# Altium schematic sheet Sheet1.SchDoc
size A3
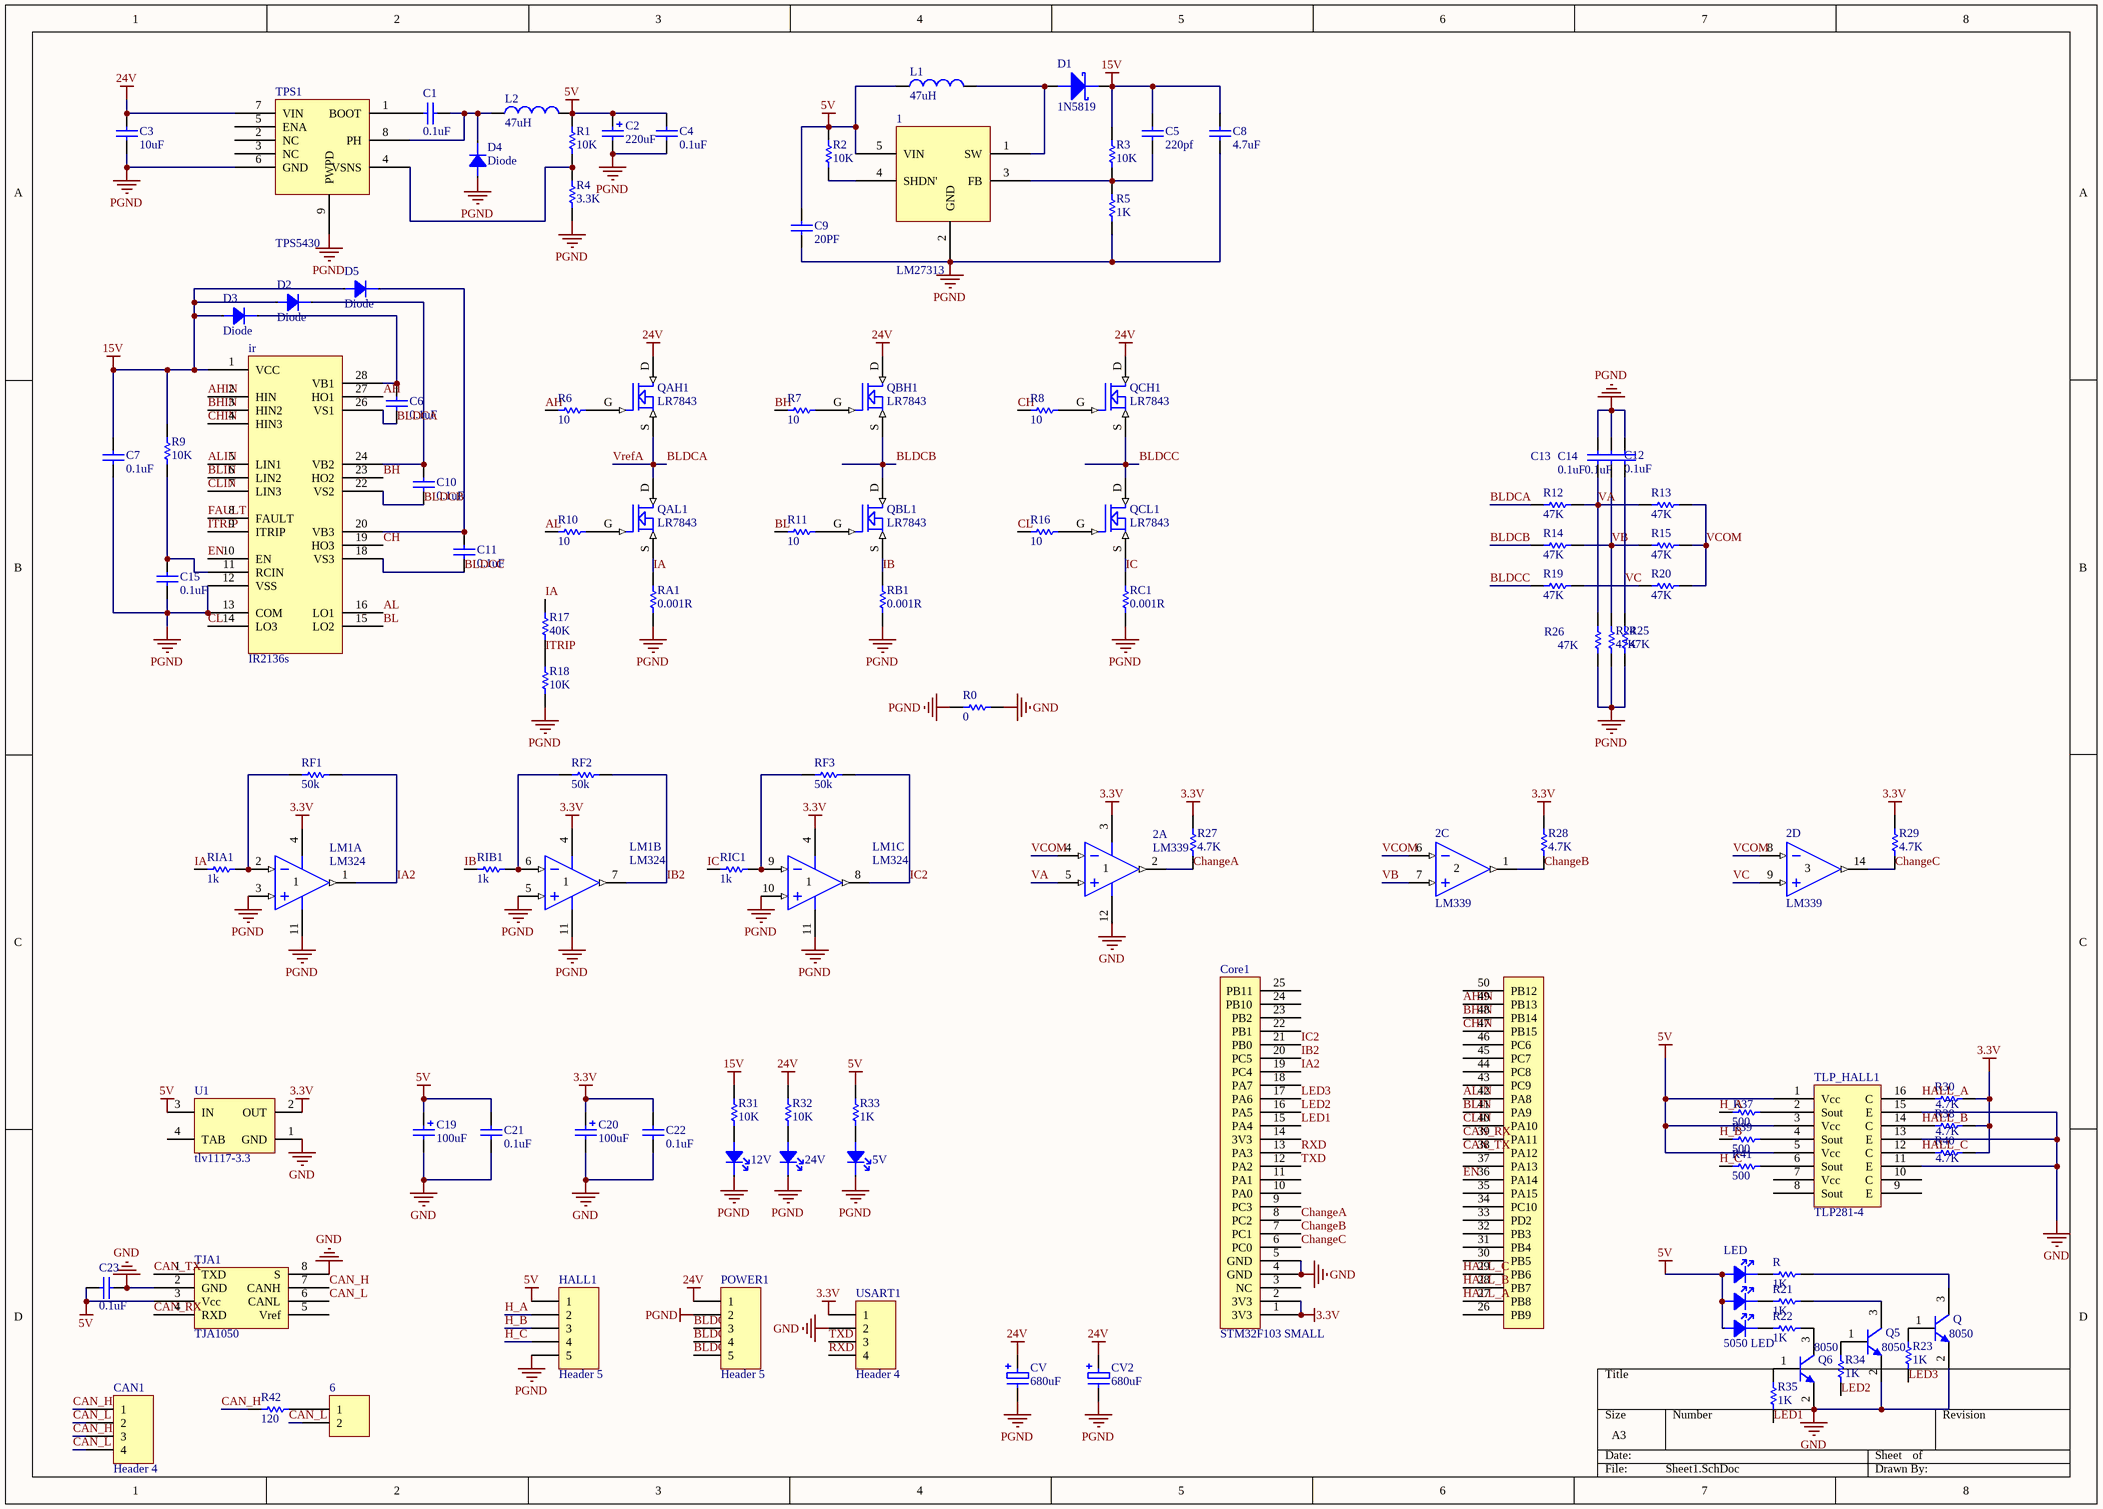
[diagram p0: Sheet1.SchDoc]

## Parts
1  LM27313  [LM27313]
2  LM339  [SOP14]  (parts A,C,D of 5)
5V  lED  [0805D]  (value not drawn)
6  Header 2  [SIP2]  (value not drawn)
12V  lED  [0805D]  (value not drawn)
24V  lED  [0805D]  (value not drawn)
C1  value 0.1uF  [CAP-MLCC-0603]  (hidden comment: Cap)
C2  value 220uF  [CAP-TAN-7343/CAPD]  (hidden comment: Cap Pol1)
C3  value 10uF  [0805C]  (hidden comment: Cap)
C4  value 0.1uF  [CAP-MLCC-0603]  (hidden comment: Cap)
C5  value 220pf  [CAP-MLCC-0603]  (hidden comment: Cap)
C6  value 0.1uF  [0805C]  (hidden comment: Cap)
C7  value 0.1uF  [0805C]  (hidden comment: Cap)
C8  value 4.7uF  [CAP-MLCC-0603]  (hidden comment: Cap)
C9  value 20PF  [CAP-MLCC-0603]  (hidden comment: Cap)
C10  value 0.1uF  [0805C]  (hidden comment: Cap)
C11  value 0.1uF  [0805C]  (hidden comment: Cap)
C12  value 0.1uF  [CAP-MLCC-0603]  (hidden comment: Cap)
C13  value 0.1uF  [CAP-MLCC-0603]  (hidden comment: Cap)
C14  value 0.1uF  [CAP-MLCC-0603]  (hidden comment: Cap)
C15  value 0.1uF  [CAP-MLCC-0603]  (hidden comment: Cap)
C19  value 100uF  [6032C]  (hidden comment: Cap Pol)
C20  value 100uF  [6032C]  (hidden comment: Cap Pol)
C21  value 0.1uF  [CAP-MLCC-0603]  (hidden comment: Cap)
C22  value 0.1uF  [CAP-MLCC-0603]  (hidden comment: Cap)
C23  value 0.1uF  [CAP-MLCC-0603]  (hidden comment: Cap)
CAN1  Header 4  [Green_4P]
Core1  STM32F103 SMALL  [STM32F103Small]
CV  680uF  [C_ELE]
CV2  680uF  [C_ELE]
D1  1N5819  [0805D]
D2  Diode  [0805D]
D3  Diode  [0805D]
D4  Diode  [SS34]
D5  Diode  [0805D]
HALL1  Header 5  [Green_5P]
ir  IR2136s  [ir2136s]
L1  value 47uH  [CD52]  (hidden comment: Inductor)
L2  value 47uH  [CD52]  (hidden comment: Inductor)
LED  5050 LED  [5050LED]
LM1  LM324  [SOP14]  (parts A,B,C of 4)
POWER1  Header 5  [Green_5P]
Q  8050  [SOT-23B_N]
Q5  8050  [SOT-23B_N]
Q6  8050  [SOT-23B_N]
QAH1  LR7843  [LR7843]
QAL1  LR7843  [LR7843]
QBH1  LR7843  [LR7843]
QBL1  LR7843  [LR7843]
QCH1  LR7843  [LR7843]
QCL1  LR7843  [LR7843]
R  value 1K  [RES-0603]  (hidden comment: Res1)
R0  value 0  [RES-0603]  (hidden comment: Res1)
R1  value 10K  [RES-0603]  (hidden comment: Res1)
R2  value 10K  [RES-0603]  (hidden comment: Res1)
R3  value 10K  [RES-0603]  (hidden comment: Res1)
R4  value 3.3K  [RES-0603]  (hidden comment: Res1)
R5  value 1K  [RES-0603]  (hidden comment: Res1)
R6  value 10  [RES-0603]  (hidden comment: Res1)
R7  value 10  [RES-0603]  (hidden comment: Res1)
R8  value 10  [RES-0603]  (hidden comment: Res1)
R9  value 10K  [RES-0603]  (hidden comment: Res1)
R10  value 10  [RES-0603]  (hidden comment: Res1)
R11  value 10  [RES-0603]  (hidden comment: Res1)
R12  value 47K  [RES-0603]  (hidden comment: Res1)
R13  value 47K  [RES-0603]  (hidden comment: Res1)
R14  value 47K  [RES-0603]  (hidden comment: Res1)
R15  value 47K  [RES-0603]  (hidden comment: Res1)
R16  value 10  [RES-0603]  (hidden comment: Res1)
R17  value 40K  [RES-0603]  (hidden comment: Res1)
R18  value 10K  [RES-0603]  (hidden comment: Res1)
R19  value 47K  [RES-0603]  (hidden comment: Res1)
R20  value 47K  [RES-0603]  (hidden comment: Res1)
R21  value 1K  [RES-0603]  (hidden comment: Res1)
R22  value 1K  [RES-0603]  (hidden comment: Res1)
R23  value 1K  [RES-0603]  (hidden comment: Res1)
R24  value 47K  [RES-0603]  (hidden comment: Res1)
R25  value 47K  [RES-0603]  (hidden comment: Res1)
R26  value 47K  [RES-0603]  (hidden comment: Res1)
R27  value 4.7K  [RES-0603]  (hidden comment: Res1)
R28  value 4.7K  [RES-0603]  (hidden comment: Res1)
R29  value 4.7K  [RES-0603]  (hidden comment: Res1)
R30  value 4.7K  [RES-0603]  (hidden comment: Res1)
R31  value 10K  [RES-0603]  (hidden comment: Res1)
R32  value 10K  [RES-0603]  (hidden comment: Res1)
R33  value 1K  [RES-0603]  (hidden comment: Res1)
R34  value 1K  [RES-0603]  (hidden comment: Res1)
R35  value 1K  [RES-0603]  (hidden comment: Res1)
R37  value 500  [RES-0603]  (hidden comment: Res1)
R38  value 4.7K  [RES-0603]  (hidden comment: Res1)
R39  value 500  [RES-0603]  (hidden comment: Res1)
R40  value 4.7K  [RES-0603]  (hidden comment: Res1)
R41  value 500  [RES-0603]  (hidden comment: Res1)
R42  value 120  [RES-0603]  (hidden comment: Res1)
RA1  value 0.001R  [2512R]  (hidden comment: Res1)
RB1  value 0.001R  [2512R]  (hidden comment: Res1)
RC1  value 0.001R  [2512R]  (hidden comment: Res1)
RF1  value 50k  [RES-0603]  (hidden comment: Res1)
RF2  value 50k  [RES-0603]  (hidden comment: Res1)
RF3  value 50k  [RES-0603]  (hidden comment: Res1)
RIA1  value 1k  [RES-0603]  (hidden comment: Res1)
RIB1  value 1k  [RES-0603]  (hidden comment: Res1)
RIC1  value 1k  [RES-0603]  (hidden comment: Res1)
TJA1  TJA1050  [TJA1050]
TLP_HALL1  TLP281-4  [SOP16]
TPS1  TPS5430  [TPS5430]
U1  tlv1117-3.3  [LM1117]
USART1  Header 4  [Green_4P]

## Nets
3.3V: 2.3(VEE) C20.1 C22.1 Core1.1(3V3) Core1.2(3V3) LM1.4(VEE) R27.2 R28.2 R29.2 R30.2 R38.2 R40.2 U1.2(OUT) USART1.1
5V: 1.5(VIN) C2.1 C4.2 C9.2 C19.1 C21.1 C23.2 HALL1.1 L1.1 L2.2 LED.A1 LED.A2 LED.A3 R1.2 R2.1 R33.2 TJA1.3(Vcc) TLP_HALL1.1(Vcc) TLP_HALL1.3(Vcc) TLP_HALL1.5(Vcc) U1.3(IN)
15V: C5.2 C7.2 C8.2 D1.K D2.A D3.A D5.A ir.1(VCC) R3.1 R9.2 R31.2
24V: C3.1 CV.1 CV2.1 POWER1.1 QAH1.D QBH1.D QCH1.D R32.2 TPS1.7(VIN)
GND: 2.12 C19.2 C20.2 C21.2 C22.2 C23.1 Core1.4(GND) Core1.5(GND) Q.2(E) Q5.2(E) Q6.2(E) R0.1 TJA1.2(GND) TJA1.8(S) TLP_HALL1.11(E) TLP_HALL1.13(E) TLP_HALL1.15(E) U1.1(GND) USART1.2
PGND: 1.2(GND) 5V.K 12V.K 24V.K C2.2 C3.2 C4.1 C7.1 C8.1 C9.1 C12.1 C13.2 C14.2 C15.1 CV.2 CV2.2 D4.A HALL1.5 ir.12(VSS) ir.13(COM) LM1.3(IN+) LM1.5(IN+) LM1.10(IN+) LM1.11(VEE) POWER1.2 R0.2 R4.1 R5.2 R18.2 R24.1 R25.1 R26.1 RA1.1 RB1.1 RC1.1 TPS1.6(GND) TPS1.9(PWPD)
AH: ir.27(HO1) R6.2
AHIN: Core1.49(PB13) ir.2(HIN)
AL: ir.16(LO1) R10.2
ALIN: Core1.42(PA8) ir.5(LIN1)
BH: ir.23(HO2) R7.2
BHIN: Core1.48(PB14) ir.3(HIN2)
BL: ir.15(LO2) R11.2
BLDCA: C6.1 ir.26(VS1) POWER1.3 QAH1.S QAL1.D R12.1  [also labelled VrefA]
BLDCB: C10.1 ir.22(VS2) POWER1.4 QBH1.S QBL1.D R14.1
BLDCC: C11.1 ir.18(VS3) POWER1.5 QCH1.S QCL1.D R19.1
BLIN: Core1.41(PA9) ir.6(LIN2)
CAN_H: CAN1.1 CAN1.3 R42.1 TJA1.7(CANH)
CAN_L: 6.2 CAN1.2 CAN1.4 TJA1.6(CANL)
CAN_RX: Core1.39(PA11) TJA1.4(RXD)
CAN_TX: Core1.38(PA12) TJA1.1(TXD)
CH: ir.19(HO3) R8.2
ChangeA: 2.2(OUT) Core1.8(PC2) R27.1
ChangeB: 2.1(OUT) Core1.7(PC1) R28.1
ChangeC: 2.14(OUT) Core1.6(PC0) R29.1
CHIN: Core1.47(PB15) ir.4(HIN3)
CL: ir.14(LO3) R16.2
CLIN: Core1.40(PA10) ir.7(LIN3)
EN: Core1.36(PA14) ir.10(EN)
FAULT: ir.8(FAULT)
H_A: HALL1.2 R37.1
H_B: HALL1.3 R39.1
H_C: HALL1.4 R41.1
HALL_A: Core1.27(PB8) R30.1 TLP_HALL1.16(C)
HALL_B: Core1.28(PB7) R38.1 TLP_HALL1.14(C)
HALL_C: Core1.29(PB6) R40.1 TLP_HALL1.12(C)
IA: QAL1.S R17.1 RA1.2 RIA1.2
IA2: Core1.19(PC4) LM1.1(OUT) RF1.1
IB: QBL1.S RB1.2 RIB1.2
IB2: Core1.20(PC5) LM1.7(OUT) RF2.1
IC: QCL1.S RC1.2 RIC1.2
IC2: Core1.21(PB0) LM1.8(OUT) RF3.1
ITRIP: ir.9(ITRIP) R17.2 R18.1
LED1: Core1.15(PA4) R35.2
LED2: Core1.16(PA5) R34.2
LED3: Core1.17(PA6) R23.2
RXD: Core1.13(PA3) USART1.4
TXD: Core1.12(PA2) USART1.3
VA: 2.5(IN+) C13.1 R12.2 R13.1 R26.2
VB: 2.7(IN+) C12.2 R14.2 R15.1 R24.2
VC: 2.9(IN+) C14.1 R19.2 R20.1 R25.2
VCOM: 2.4(IN-) 2.6(IN-) 2.8(IN-) R13.2 R15.2 R20.2
Net1_1: 1.1(SW) D1.A L1.2
Net1_3: 1.3(FB) C5.1 R3.2 R5.1
Net1_4: 1.4(SHDN') R2.2
Net5V_A: 5V.A R33.1
Net6_1: 6.1 R42.2
Net12V_A: 12V.A R31.1
Net24V_A: 24V.A R32.1
NetC1_1: C1.1 TPS1.1(BOOT)
NetC1_2: C1.2 D4.K L2.1 TPS1.8(PH)
NetC6_2: C6.2 D3.K ir.28(VB1)
NetC10_2: C10.2 D2.K ir.24(VB2)
NetC11_2: C11.2 D5.K ir.20(VB3)
NetC15_2: C15.2 ir.11(RCIN) R9.1
NetLED_K1: LED.K1 R.2
NetLED_K2: LED.K2 R21.2
NetLED_K3: LED.K3 R22.2
NetLM1_2: LM1.2(IN-) RF1.2 RIA1.1
NetLM1_6: LM1.6(IN-) RF2.2 RIB1.1
NetLM1_9: LM1.9(IN-) RF3.2 RIC1.1
NetQ5_1: Q5.1(B) R34.1
NetQ5_3: Q5.3(C) R21.1
NetQ6_1: Q6.1(B) R35.1
NetQ6_3: Q6.3(C) R22.1
NetQ_1: Q.1(B) R23.1
NetQ_3: Q.3(C) R.1
NetQAH1_G: QAH1.G R6.1
NetQAL1_G: QAL1.G R10.1
NetQBH1_G: QBH1.G R7.1
NetQBL1_G: QBL1.G R11.1
NetQCH1_G: QCH1.G R8.1
NetQCL1_G: QCL1.G R16.1
NetR1_1: R1.1 R4.2 TPS1.4(VSNS)
NetR37_2: R37.2 TLP_HALL1.2(Sout)
NetR39_2: R39.2 TLP_HALL1.4(Sout)
NetR41_2: R41.2 TLP_HALL1.6(Sout)

Not connected (* = marked no-connect by the designer): Core1 3(NC) 9(PC3) 10(PA0) 11(PA1) 14(3V3) 18(PA7) 22(PB1) 23(PB2) 24(PB10) 25(PB11) 26(PB9) 30(PB5) 31(PB4) 32(PB3) 33(PD2) 34(PC10) 35(PA15) 37(PA13) 43(PC9) 44(PC8) 45(PC7) 46(PC6) 50(PB12); ir 17 21 25; TJA1 5(Vref); TLP_HALL1 7(Vcc) 8(Sout) 9(E) 10(C); TPS1 2(NC) 3(NC) 5(ENA); U1 4(TAB)

## Library data of the parts
5V 12V 24V = 00-D-LED
6 = Header 2: Header, 2-Pin; LatestRevisionDate: 17-Jul-2002; LatestRevisionNote: Re-released for DXP Platform.; Publisher: Altium Limited
C1 C3 C4 C6 C7 C10-C15 C21-C23 = Cap: Capacitor; Published: 8-Jun-2000; LatestRevisionDate: 17-Jul-2002; LatestRevisionNote: Re-released for DXP Platform.; PackageReference: RAD-0.3; Publisher: Altium Limited
C2 = Cap Pol1: Polarized Capacitor (Radial); Published: 8-Jun-2000; LatestRevisionDate: 17-Jul-2002; LatestRevisionNote: Re-released for DXP Platform.; PackageReference: RB7.6-15; Publisher: Altium Limited
C5 C8 C9 = Cap_1: Capacitor; Published: 8-Jun-2000; LatestRevisionDate: 17-Jul-2002; LatestRevisionNote: Re-released for DXP Platform.; PackageReference: RAD-0.3; Publisher: Altium Limited
C19 C20 = Cap Pol: Polarized Capacitor (Radial); Published: 8-Jun-2000; LatestRevisionDate: 17-Jul-2002; LatestRevisionNote: Re-released for DXP Platform.; PackageReference: RB7.6-15; Publisher: Altium Limited
CAN1 USART1 = Header 4: Header, 4-Pin; LatestRevisionDate: 17-Jul-2002; LatestRevisionNote: Re-released for DXP Platform.; Publisher: Altium Limited
CV CV2 = CAP-ELE: 电解电容; Value: *μF; Published: 8-Jun-2000; LatestRevisionDate: 17-Jul-2002; LatestRevisionNote: Re-released for DXP Platform.; PackageReference: RB7.6-15; Publisher: Altium Limited; PackageDescription: Polarized Capacitor (Radial); 2 Leads
D1 = D-MBRA140T3: MBRA140T3
HALL1 POWER1 = Header 5: Header, 5-Pin; LatestRevisionDate: 17-Jul-2002; LatestRevisionNote: Re-released for DXP Platform.; Publisher: Altium Limited
L1 L2 = Inductor: Code_IEC: 1005; Published: 8-Jun-2000; LatestRevisionDate: 17-Jul-2002; LatestRevisionNote: Re-released for DXP Platform.; PackageReference: 0402-A; Publisher: Altium Limited; Code_JEITA: 0402
Q Q5 Q6 = QNPN: NPN Bipolar Transistor; Published: 8-Jun-2000; LatestRevisionDate: 29-May-2009; LatestRevisionNote: IPC-7351 Footprint Added.; PackageVersion: Aug-1999; PackageReference: SOT-23B; Publisher: Altium Limited; PackageDescription: 3-Pin SOT-23 Package 0.95 mm Pitch, 2.4 mm Lead Span
R R0 R1 R4 R6-R35 R37-R42 RA1 RB1 RC1 RF1-RF3 RIA1 RIB1 RIC1 = Res1: Resistor; Published: 8-Jun-2000; LatestRevisionDate: 17-Jul-2002; LatestRevisionNote: Re-released for DXP Platform.; PackageReference: AXIAL-0.3; Publisher: Altium Limited
R2 R3 R5 = Res1_1: Resistor; Published: 8-Jun-2000; LatestRevisionDate: 17-Jul-2002; LatestRevisionNote: Re-released for DXP Platform.; PackageReference: AXIAL-0.3; Publisher: Altium Limited
TJA1 = TJA1050: CAN总线收发器
TLP_HALL1 = IC-TLP281-4
U1 = LM1117IMP-5.0: 800mA Low-Dropout Linear Regulator; Manufacturer: National Semiconductor; CompType: LDO IC; PackageTopMarking: XYTT*N06B; PowerWise: N; Published: 4-Dec-2008; DatasheetVersion: Apr-2006; PackageVersion: revB, Apr-2003; PackageReference: MP04A; Publisher: Altium Limited; PackageDescription: Molded SOT-223, 6.50 x 3.56 x 1.6mm Body, 4 Lead, 2.3mm Pitch; PartNumber: LM1117IMP-5.0; RoHS: O; PinCount: 4; DigiKeyPartNumber: LM1117IMP-5.0CT-ND; Code_JEDEC: TO-261-AA; Code_IPC: SOT223-4; ComponentLink1Description: LM1117 Datasheet; ComponentLink1URL: http://www.national.com/ds/LM/LM1117.pdf; ComponentLink2Description: LM1117 Web Page; ComponentLink2URL: http://www.national.com/pf/LM/LM1117.html; ComponentLink3Description: MP04A Package Page; ComponentLink3URL: http://www.national.com/packaging/folders/mp04a.html